# EAGLE design breakout_stm32f407 (EAGLE 5.12)

## Sheet 1 of 3
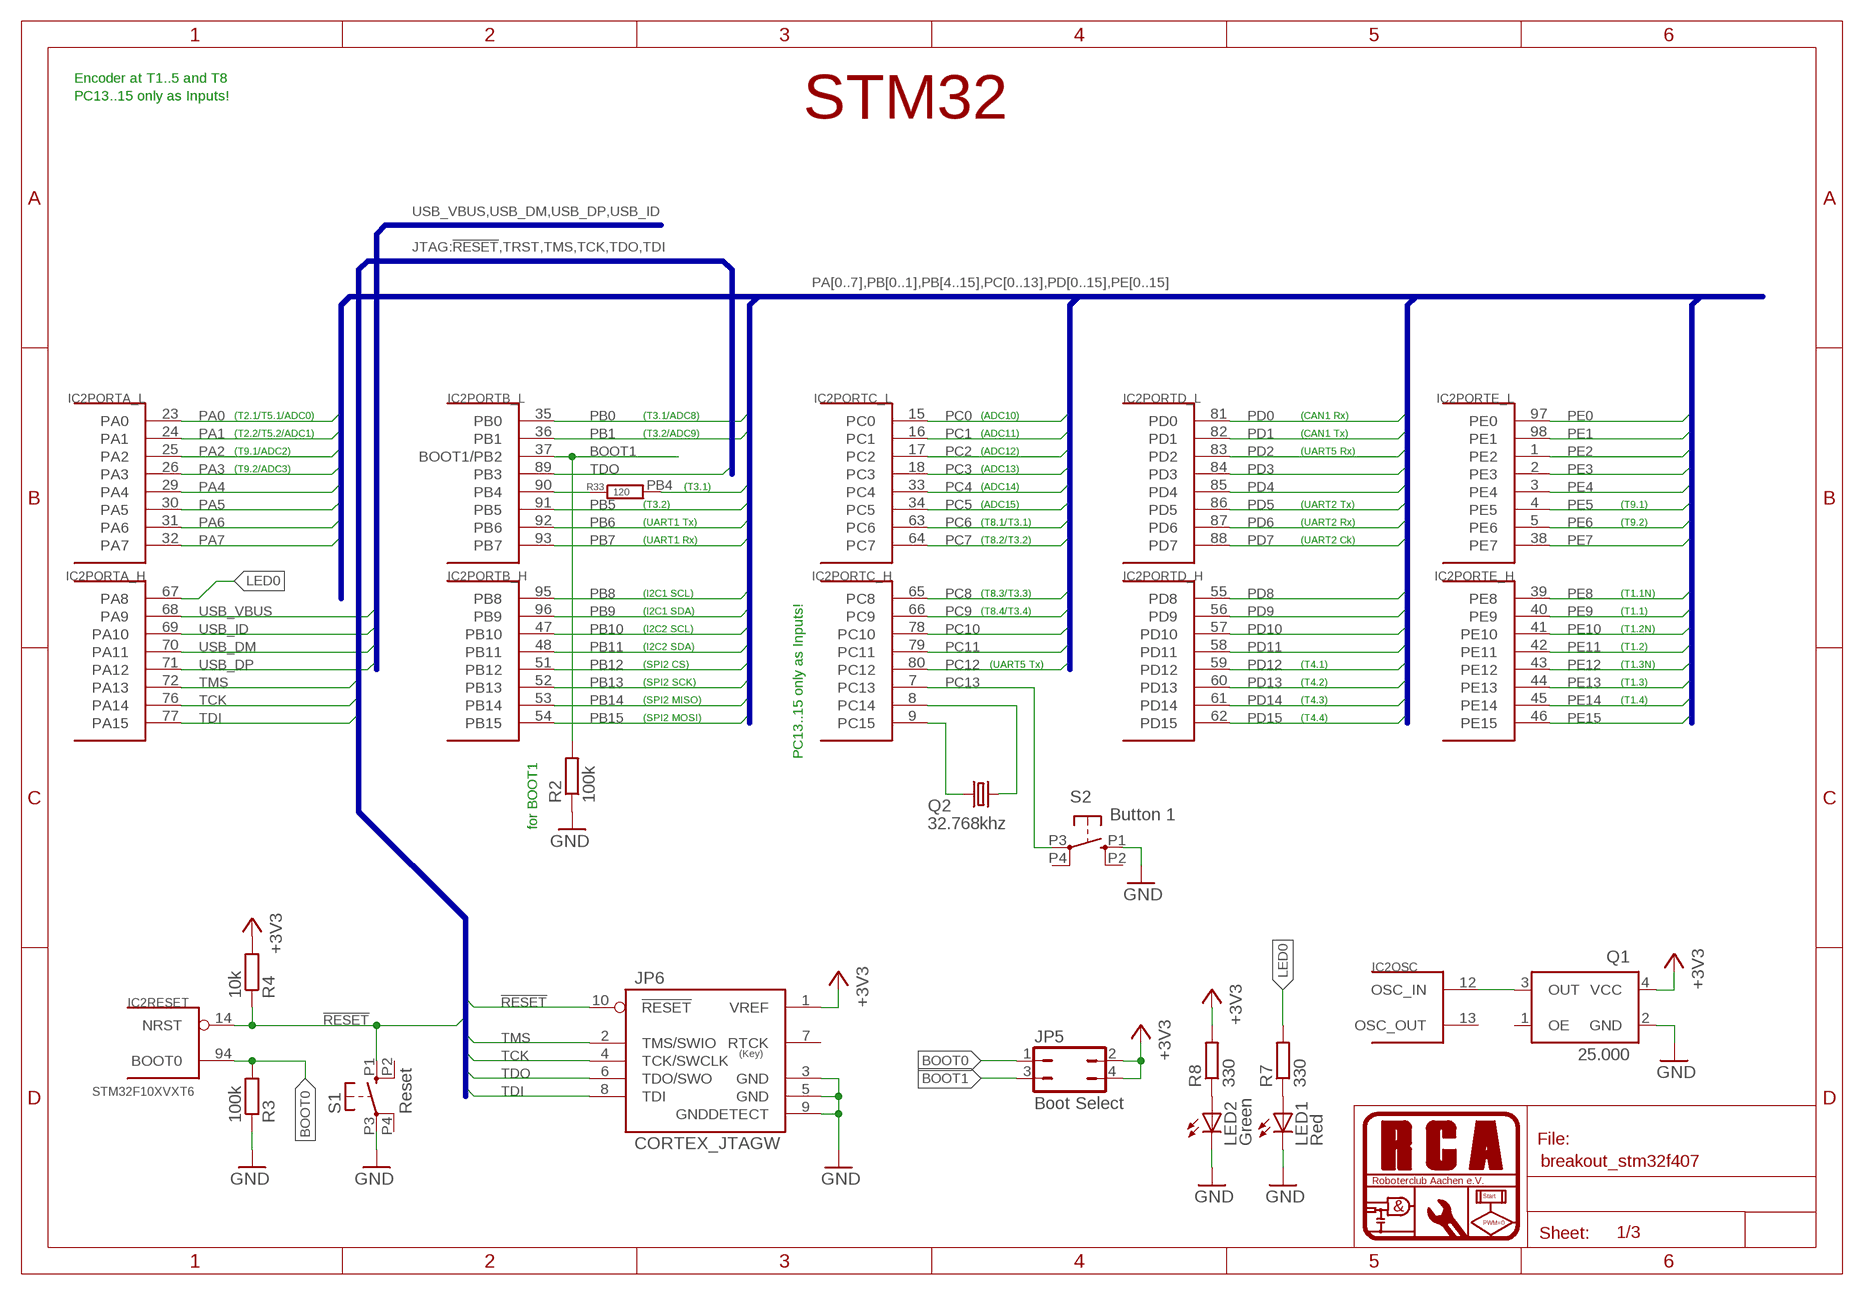
[diagram p0: schematic, sheet 1]

### Parts
IC2  STM32F10XVXT6  [TQFP100]
JP5  Boot Select  JP2Q  [JP2Q]
JP6  CORTEX_JTAGW  [ML10]
LED1  Red  LEDCHIPLED_0805  [CHIPLED_0805]
LED2  Green  LEDCHIPLED_0805  [CHIPLED_0805]
Q1  25.000  XO53  [XO53]
Q2  32.768khz  CRYSTALTC26H  [TC26H]
R2  100k  R-EU_R0805  [R0805]
R3  100k  R-EU_R0805  [R0805]
R4  10k  R-EU_R0805  [R0805]
R7  330  R-EU_R0805  [R0805]
R8  330  R-EU_R0805  [R0805]
R33  120  R-EU_R0805  [R0805]
S1  Reset  10-XXLSH  [B3F-10XX-SMD]
S2  Button 1  10-XXLSH  [B3F-10XX-SMD]

### Nets
!RESET: IC2.14(RESET:NRST) JP6.10(!RESET) R4.1 S1.P1(S)
+3V3: JP5.2 JP5.4 JP6.1(VREF) Q1.4(VCC) R4.2 R8.2 ; also sheet 2,3
BOOT0: IC2.94(RESET:BOOT0) JP5.1 R3.2
BOOT1: IC2.37(PORTB_L:BOOT1/PB2) JP5.3 R2.2
GND: JP6.3(GND) JP6.5(GND) JP6.9(GNDDETECT) LED1.C LED2.C Q1.2(GND) R2.1 R3.1 S1.P3(P) S2.P1(S) ; also sheet 2,3
LED0: IC2.67(PORTA_H:PA8) R7.2
N$1: IC2.12(OSC:OSC_IN) Q1.3(OUT)
N$2: IC2.9(PORTC_H:PC15) Q2.1
N$3: IC2.8(PORTC_H:PC14) Q2.2
N$4: LED1.A R7.1
N$9: LED2.A R8.1
N$34: IC2.90(PORTB_L:PB4) R33.1
PA0: IC2.23(PORTA_L:PA0) ; also sheet 2
PA1: IC2.24(PORTA_L:PA1) ; also sheet 2
PA2: IC2.25(PORTA_L:PA2) ; also sheet 2
PA3: IC2.26(PORTA_L:PA3) ; also sheet 2
PA4: IC2.29(PORTA_L:PA4) ; also sheet 2
PA5: IC2.30(PORTA_L:PA5) ; also sheet 2
PA6: IC2.31(PORTA_L:PA6) ; also sheet 2
PA7: IC2.32(PORTA_L:PA7) ; also sheet 2
PB0: IC2.35(PORTB_L:PB0) ; also sheet 2
PB1: IC2.36(PORTB_L:PB1) ; also sheet 2
PB4: R33.2 ; also sheet 2
PB5: IC2.91(PORTB_L:PB5) ; also sheet 2
PB6: IC2.92(PORTB_L:PB6) ; also sheet 2
PB7: IC2.93(PORTB_L:PB7) ; also sheet 2
PB8: IC2.95(PORTB_H:PB8) ; also sheet 2
PB9: IC2.96(PORTB_H:PB9) ; also sheet 2
PB10: IC2.47(PORTB_H:PB10) ; also sheet 2
PB11: IC2.48(PORTB_H:PB11) ; also sheet 2
PB12: IC2.51(PORTB_H:PB12) ; also sheet 2
PB13: IC2.52(PORTB_H:PB13) ; also sheet 2
PB14: IC2.53(PORTB_H:PB14) ; also sheet 2
PB15: IC2.54(PORTB_H:PB15) ; also sheet 2
PC0: IC2.15(PORTC_L:PC0) ; also sheet 2
PC1: IC2.16(PORTC_L:PC1) ; also sheet 2
PC2: IC2.17(PORTC_L:PC2) ; also sheet 2
PC3: IC2.18(PORTC_L:PC3) ; also sheet 2
PC4: IC2.33(PORTC_L:PC4) ; also sheet 2
PC5: IC2.34(PORTC_L:PC5) ; also sheet 2
PC6: IC2.63(PORTC_L:PC6) ; also sheet 2
PC7: IC2.64(PORTC_L:PC7) ; also sheet 2
PC8: IC2.65(PORTC_H:PC8) ; also sheet 2
PC9: IC2.66(PORTC_H:PC9) ; also sheet 2
PC10: IC2.78(PORTC_H:PC10) ; also sheet 2
PC11: IC2.79(PORTC_H:PC11) ; also sheet 2
PC12: IC2.80(PORTC_H:PC12) ; also sheet 2
PC13: IC2.7(PORTC_H:PC13) S2.P3(P)
PD0: IC2.81(PORTD_L:PD0) ; also sheet 2
PD1: IC2.82(PORTD_L:PD1) ; also sheet 2
PD2: IC2.83(PORTD_L:PD2) ; also sheet 2
PD3: IC2.84(PORTD_L:PD3) ; also sheet 2
PD4: IC2.85(PORTD_L:PD4) ; also sheet 2
PD5: IC2.86(PORTD_L:PD5) ; also sheet 2
PD6: IC2.87(PORTD_L:PD6) ; also sheet 2
PD7: IC2.88(PORTD_L:PD7) ; also sheet 2
PD8: IC2.55(PORTD_H:PD8) ; also sheet 2
PD9: IC2.56(PORTD_H:PD9) ; also sheet 2
PD10: IC2.57(PORTD_H:PD10) ; also sheet 2
PD11: IC2.58(PORTD_H:PD11) ; also sheet 2
PD12: IC2.59(PORTD_H:PD12) ; also sheet 2
PD13: IC2.60(PORTD_H:PD13) ; also sheet 2
PD14: IC2.61(PORTD_H:PD14) ; also sheet 2
PD15: IC2.62(PORTD_H:PD15) ; also sheet 2
PE0: IC2.97(PORTE_L:PE0) ; also sheet 2
PE1: IC2.98(PORTE_L:PE1) ; also sheet 2
PE2: IC2.1(PORTE_L:PE2) ; also sheet 2
PE3: IC2.2(PORTE_L:PE3) ; also sheet 2
PE4: IC2.3(PORTE_L:PE4) ; also sheet 2
PE5: IC2.4(PORTE_L:PE5) ; also sheet 2
PE6: IC2.5(PORTE_L:PE6) ; also sheet 2
PE7: IC2.38(PORTE_L:PE7) ; also sheet 2
PE8: IC2.39(PORTE_H:PE8) ; also sheet 2
PE9: IC2.40(PORTE_H:PE9) ; also sheet 2
PE10: IC2.41(PORTE_H:PE10) ; also sheet 2
PE11: IC2.42(PORTE_H:PE11) ; also sheet 2
PE12: IC2.43(PORTE_H:PE12) ; also sheet 2
PE13: IC2.44(PORTE_H:PE13) ; also sheet 2
PE14: IC2.45(PORTE_H:PE14) ; also sheet 2
PE15: IC2.46(PORTE_H:PE15) ; also sheet 2
TCK: IC2.76(PORTA_H:PA14) JP6.4(TCK/SWCLK)
TDI: IC2.77(PORTA_H:PA15) JP6.8(TDI)
TDO: IC2.89(PORTB_L:PB3) JP6.6(TDO/SWO)
TMS: IC2.72(PORTA_H:PA13) JP6.2(TMS/SWIO)
USB_DM: IC2.70(PORTA_H:PA11) ; also sheet 2
USB_DP: IC2.71(PORTA_H:PA12) ; also sheet 2
USB_ID: IC2.69(PORTA_H:PA10) ; also sheet 2
USB_VBUS: IC2.68(PORTA_H:PA9) ; also sheet 2,3
Unconnected: IC2.13(OSC:OSC_OUT) JP6.7(RTCK) Q1.1(OE) S1.P2(S1) S1.P4(P1) S2.P2(S1) S2.P4(P1)

### Buses
JTAG:!RESET,TRST,TMS,TCK,TDO,TDI
USB_VBUS,USB_DM,USB_DP,USB_ID
PA[0..7],PB[0..1],PB[4..15],PC[0..13],PD[0..15],PE[0..15]

### Notes on the sheet
- Encoder at T1..5 and T8
- PC13..15 only as Inputs!
- STM32
- (T2.1/T5.1/ADC0) | (T3.1/ADC8) | (ADC10) | (CAN1 Rx)
- (T2.2/T5.2/ADC1) | (T3.2/ADC9) | (ADC11) | (CAN1 Tx)
- (T9.1/ADC2) | (ADC12) | (UART5 Rx)
- (T9.2/ADC3) | (ADC13)
- (T3.1) | (ADC14)
- (T3.2) | (ADC15) | (UART2 Tx) | (T9.1)
- (UART1 Tx) | (T8.1/T3.1) | (UART2 Rx) | (T9.2)
- (UART1 Rx) | (T8.2/T3.2) | (UART2 Ck)
- (I2C1 SCL) | (T8.3/T3.3) | (T1.1N)
- (I2C1 SDA) | (T8.4/T3.4) | (T1.1)
- (I2C2 SCL) | (T1.2N)
- (I2C2 SDA) | (T1.2)
- (SPI2 CS) | (UART5 Tx) | (T4.1) | (T1.3N)
- (SPI2 SCK) | (T4.2) | (T1.3)
- (SPI2 MISO) | (T4.3) | (T1.4)
- (SPI2 MOSI) | (T4.4)
- PC13..15 only as Inputs!
- for BOOT1

## Sheet 2 of 3
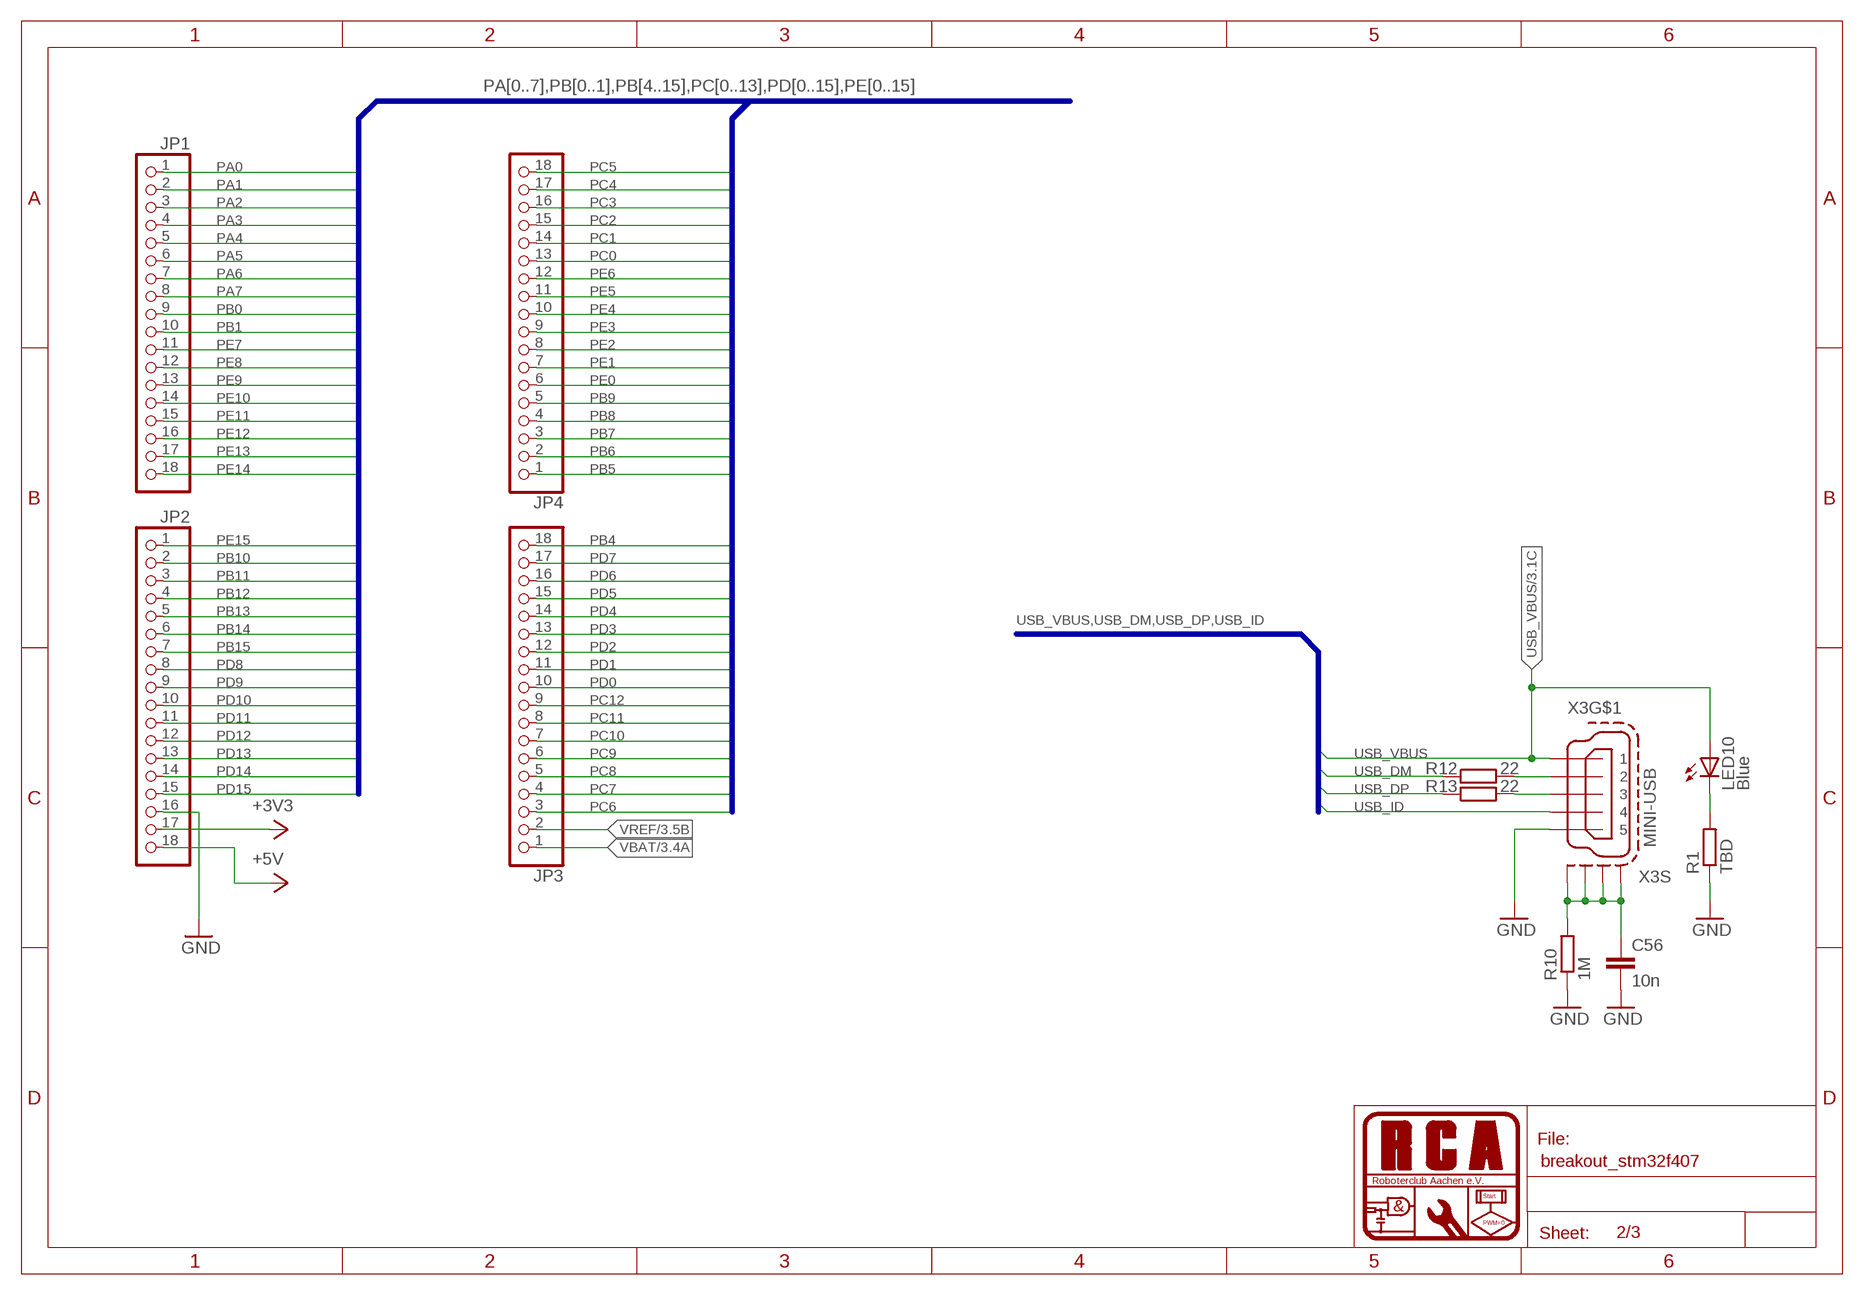
[diagram p1: schematic, sheet 2]

### Parts
C56  10n  C-EUC0603  [C0603]
JP1  PINHD-1X18_2.54  [1X18]
JP2  PINHD-1X18_2.54  [1X18]
JP3  PINHD-1X18_2.54  [1X18]
JP4  PINHD-1X18_2.54  [1X18]
LED10  Blue  LEDCHIPLED_0805  [CHIPLED_0805]
R1  TBD  R-EU_R0805  [R0805]
R10  1M  R-EU_R0805  [R0805]
R12  22  R-EU_R0805  [R0805]
R13  22  R-EU_R0805  [R0805]
X3  MINI-USB  MINI-USB-SCHIELD-32005-201  [32005-201]

### Nets
+3V3: JP2.17 ; also sheet 1,3
+5V: JP2.18 ; also sheet 3
GND: C56.2 JP2.16 R1.1 R10.1 X3.5 ; also sheet 1,3
N$16: R12.2 X3.2
N$17: R13.2 X3.3
N$33: LED10.C R1.2
N$42: C56.1 R10.2 X3.M1(S:S1) X3.M2(S:S2) X3.M3(S:S3) X3.M4(S:S4)
PA0: JP1.1 ; also sheet 1
PA1: JP1.2 ; also sheet 1
PA2: JP1.3 ; also sheet 1
PA3: JP1.4 ; also sheet 1
PA4: JP1.5 ; also sheet 1
PA5: JP1.6 ; also sheet 1
PA6: JP1.7 ; also sheet 1
PA7: JP1.8 ; also sheet 1
PB0: JP1.9 ; also sheet 1
PB1: JP1.10 ; also sheet 1
PB4: JP3.18 ; also sheet 1
PB5: JP4.1 ; also sheet 1
PB6: JP4.2 ; also sheet 1
PB7: JP4.3 ; also sheet 1
PB8: JP4.4 ; also sheet 1
PB9: JP4.5 ; also sheet 1
PB10: JP2.2 ; also sheet 1
PB11: JP2.3 ; also sheet 1
PB12: JP2.4 ; also sheet 1
PB13: JP2.5 ; also sheet 1
PB14: JP2.6 ; also sheet 1
PB15: JP2.7 ; also sheet 1
PC0: JP4.13 ; also sheet 1
PC1: JP4.14 ; also sheet 1
PC2: JP4.15 ; also sheet 1
PC3: JP4.16 ; also sheet 1
PC4: JP4.17 ; also sheet 1
PC5: JP4.18 ; also sheet 1
PC6: JP3.3 ; also sheet 1
PC7: JP3.4 ; also sheet 1
PC8: JP3.5 ; also sheet 1
PC9: JP3.6 ; also sheet 1
PC10: JP3.7 ; also sheet 1
PC11: JP3.8 ; also sheet 1
PC12: JP3.9 ; also sheet 1
PD0: JP3.10 ; also sheet 1
PD1: JP3.11 ; also sheet 1
PD2: JP3.12 ; also sheet 1
PD3: JP3.13 ; also sheet 1
PD4: JP3.14 ; also sheet 1
PD5: JP3.15 ; also sheet 1
PD6: JP3.16 ; also sheet 1
PD7: JP3.17 ; also sheet 1
PD8: JP2.8 ; also sheet 1
PD9: JP2.9 ; also sheet 1
PD10: JP2.10 ; also sheet 1
PD11: JP2.11 ; also sheet 1
PD12: JP2.12 ; also sheet 1
PD13: JP2.13 ; also sheet 1
PD14: JP2.14 ; also sheet 1
PD15: JP2.15 ; also sheet 1
PE0: JP4.6 ; also sheet 1
PE1: JP4.7 ; also sheet 1
PE2: JP4.8 ; also sheet 1
PE3: JP4.9 ; also sheet 1
PE4: JP4.10 ; also sheet 1
PE5: JP4.11 ; also sheet 1
PE6: JP4.12 ; also sheet 1
PE7: JP1.11 ; also sheet 1
PE8: JP1.12 ; also sheet 1
PE9: JP1.13 ; also sheet 1
PE10: JP1.14 ; also sheet 1
PE11: JP1.15 ; also sheet 1
PE12: JP1.16 ; also sheet 1
PE13: JP1.17 ; also sheet 1
PE14: JP1.18 ; also sheet 1
PE15: JP2.1 ; also sheet 1
USB_DM: R12.1 ; also sheet 1
USB_DP: R13.1 ; also sheet 1
USB_ID: X3.4 ; also sheet 1
USB_VBUS: LED10.A X3.1 ; also sheet 1,3
VBAT: JP3.1 ; also sheet 3
VREF: JP3.2 ; also sheet 3

### Buses
USB_VBUS,USB_DM,USB_DP,USB_ID
PA[0..7],PB[0..1],PB[4..15],PC[0..13],PD[0..15],PE[0..15]

## Sheet 3 of 3
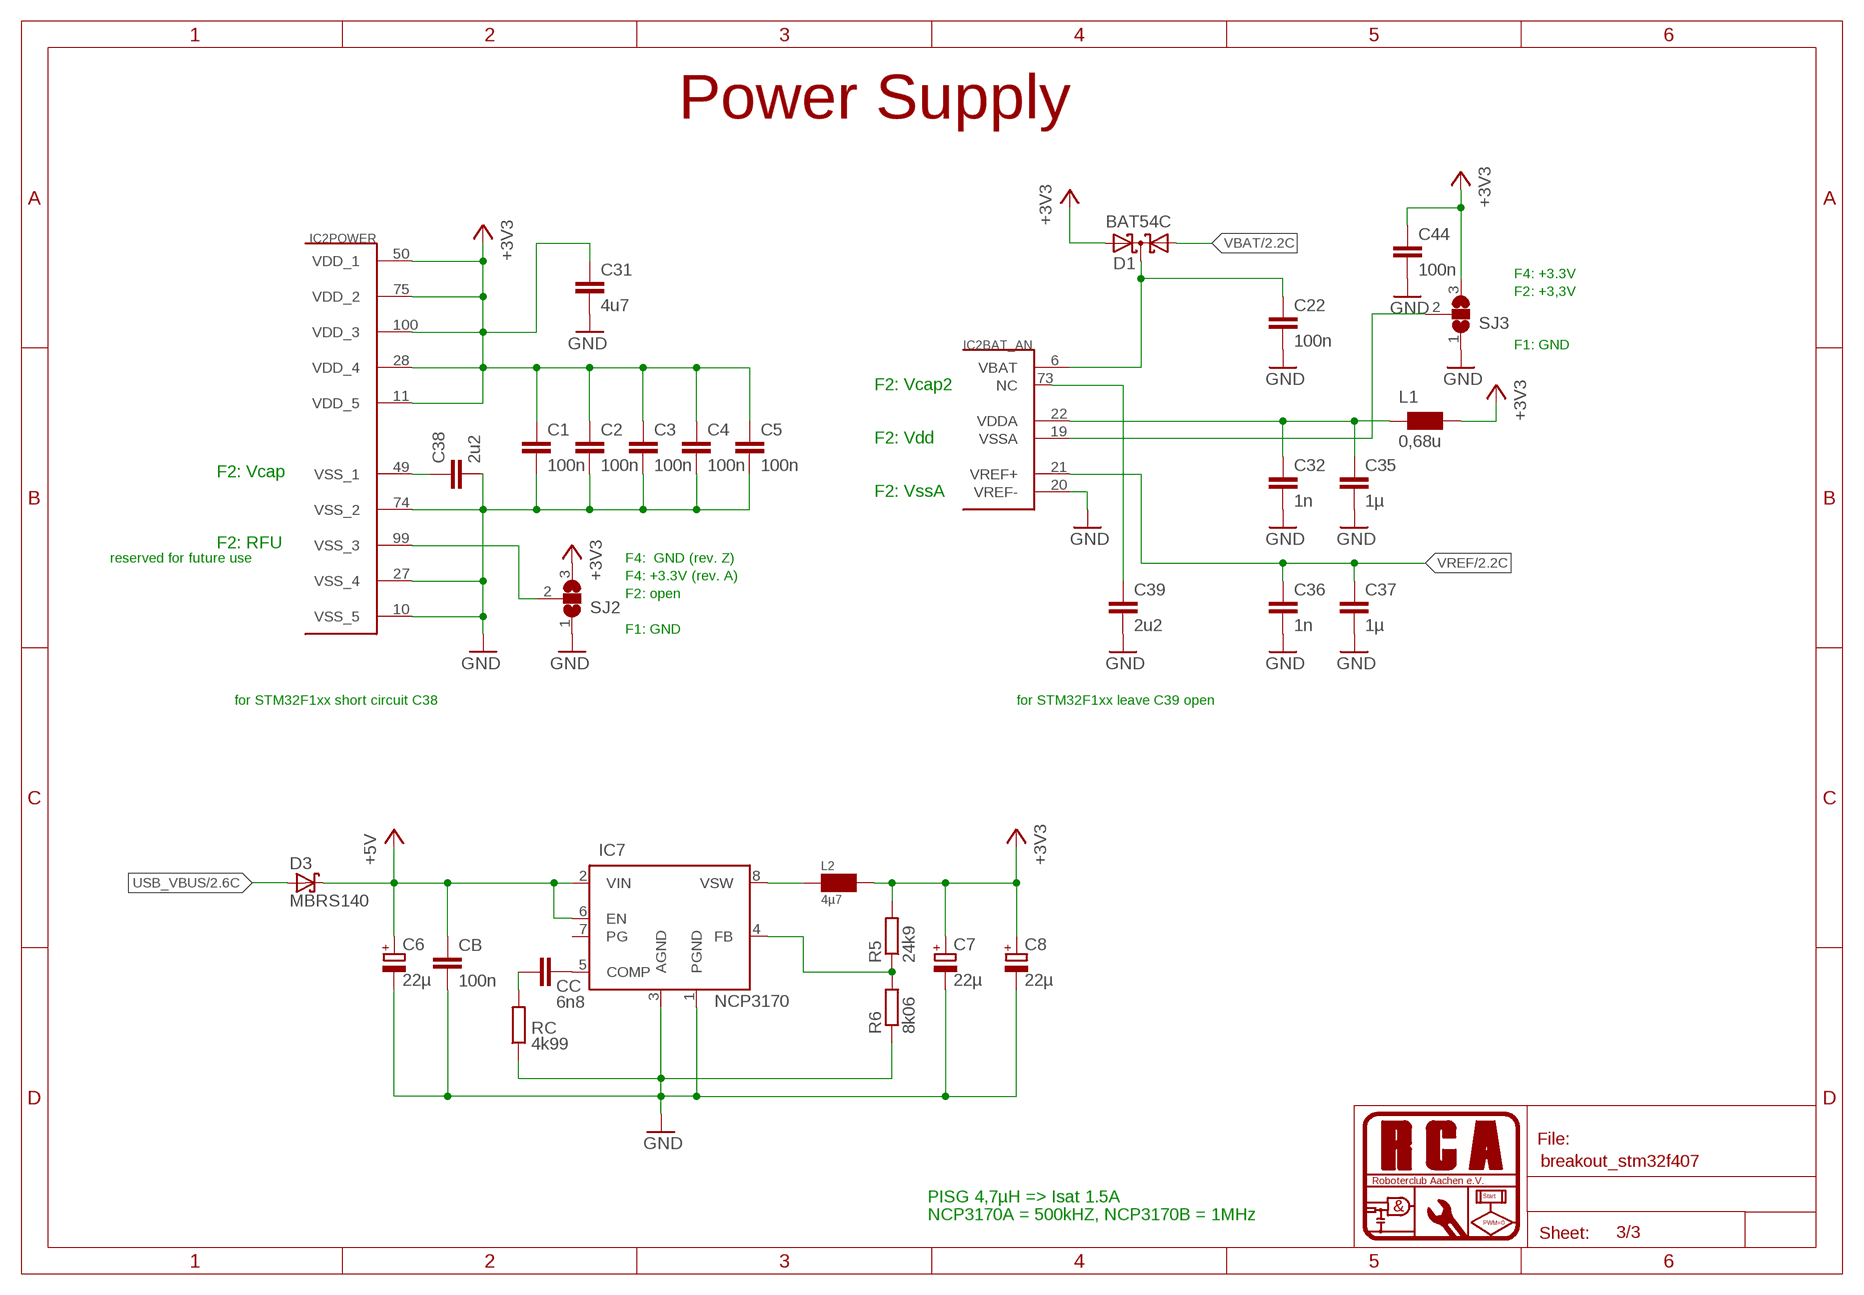
[diagram p2: schematic, sheet 3]

### Parts
C1  100n  C-EUC0603  [C0603]
C2  100n  C-EUC0603  [C0603]
C3  100n  C-EUC0603  [C0603]
C4  100n  C-EUC0603  [C0603]
C5  100n  C-EUC0603  [C0603]
C6  22µ  CPOL-EUSMCD  [SMC_D]
C7  22µ  CPOL-EUSMCC  [SMC_C]
C8  22µ  CPOL-EUSMCC  [SMC_C]
C22  100n  C-EUC0603  [C0603]
C31  4u7  C-EUC0805  [C0805]
C32  1n  C-EUC0603  [C0603]
C35  1µ  C-EUC0805  [C0805]
C36  1n  C-EUC0603  [C0603]
C37  1µ  C-EUC0805  [C0805]
C38  2u2  C-EUC0805  [C0805]
C39  2u2  C-EUC0805  [C0805]
C44  100n  C-EUC0603  [C0603]
CB  100n  C-EUC0603  [C0603]
CC  6n8  C-EUC0805  [C0805]
D1  BAT54C  [SOT23]
D3  MBRS140  MBRS130LT3  [SMB]
IC7  NCP3170  [SO08]
L1  0,68u  WE-KIHQ_0805  [WE-KI_0805_B]
L2  4µ7  INDUCTOR-PISG  [L-PISG]
R5  24k9  R-EU_M0805  [M0805]
R6  8k06  R-EU_M0805  [M0805]
RC  4k99  R-EU_M0805  [M0805]
SJ2  SJ2WS  [SJ_2S]
SJ3  SJ2WS  [SJ_2S]

### Nets
+3V3: C1.1 C2.1 C3.1 C4.1 C5.1 C7.+ C8.+ C31.1 C44.1 D1.2(A2) IC2.11(POWER:VDD_5) IC2.28(POWER:VDD_4) IC2.50(POWER:VDD_1) IC2.75(POWER:VDD_2) IC2.100(POWER:VDD_3) L1.1 L2.2 R5.2 SJ2.3 SJ3.3 ; also sheet 1,2
+5V: C6.+ CB.1 D3.C IC7.2(VIN) IC7.6(EN) ; also sheet 2
GND: C1.2 C2.2 C3.2 C4.2 C5.2 C6.- C7.- C8.- C22.2 C31.2 C32.2 C35.2 C36.2 C37.2 C38.2 C39.2 C44.2 CB.2 IC2.10(POWER:VSS_5) IC2.20(BAT_AN:VREF-) IC2.27(POWER:VSS_4) IC2.74(POWER:VSS_2) IC7.1(PGND) IC7.3(AGND) R6.1 RC.1 SJ2.1 SJ3.1 ; also sheet 1,2
N$5: CC.2 RC.2
N$6: CC.1 IC7.5(COMP)
N$7: IC7.8(VSW) L2.1
N$8: IC7.4(FB) R5.1 R6.2
N$27: C38.1 IC2.49(POWER:VSS_1)
N$28: IC2.99(POWER:VSS_3) SJ2.2
N$29: C39.1 IC2.73(BAT_AN:NC)
N$30: IC2.19(BAT_AN:VSSA) SJ3.2
N$36: C32.1 C35.1 IC2.22(BAT_AN:VDDA) L1.2
USB_VBUS: D3.A ; also sheet 1,2
VBAT: D1.1(A1) ; also sheet 2
VBAT_: C22.1 D1.3(CC) IC2.6(BAT_AN:VBAT)
VREF: C36.1 C37.1 IC2.21(BAT_AN:VREF+) ; also sheet 2
Unconnected: IC7.7(PG)

### Notes on the sheet
- Power Supply
- F4: +3.3V
- F2: +3,3V
- F1: GND
- F2: Vcap2
- F2: Vdd
- F2: Vcap
- F2: VssA
- F2: RFU
- reserved for future use | F4:  GND (rev. Z)
- F4: +3.3V (rev. A)
- F2: open
- F1: GND
- for STM32F1xx short circuit C38 | for STM32F1xx leave C39 open
- PISG 4,7µH => Isat 1.5A
- NCP3170A = 500kHZ, NCP3170B = 1MHz

## Library data of the parts
C1-C5 C22 C31 C32 C35-C39 C44 C56 CB CC = rcl:C-EU: CAPACITOR, European symbol
C6-C8 = rcl:CPOL-EU: POLARIZED CAPACITOR, European symbol
D1 = diode:BAT54C: Schottky Diodes Source: Fairchild .. BAT54.pdf
D3 = diode:MBRS130LT3: Schottky Power Rectifier Source: http://www.onsemi.com/pub/Collateral/MBRS130LT3-D.PDF
IC2 = stm32:STM32F10XVXT6: STM32F101/103 100 pin LQFP
IC7 = rca_spgversorgung:NCP3170: Synchronous PWM Switching Converter The NCP3170 is a flexible synchronous PWM Switching Buck Regulator. The NCP3170 operates from 4.5V to 18V, sourcing up to 3A and is capable of producing output voltages as low as 0.8V. The NCP3170 also incorporates current mode control. To reduce the number of external components, a number of features are internally set including soft start, power good detection, and switching frequency. The NCP3170 is currently available in an SOIC-8 package.
JP1-JP4 = pinhead2:PINHD-1X18: PIN HEADER
JP5 = jumper:JP2Q: JUMPER
JP6 = rca_stecker:CORTEX_JTAG
L1 = wuerth-elektronik:WE-KIHQ: SMD Wire Wound Ceramic Inductor WE-KIHQ - High current - Highest Quality factor in size 0805 - up to 98 - High thermal stability - High SRF -- Bluetooth -- Wireless LAN -- RF oscillation circuit -- IF impedance matching -- IG choke
L2 = rca_sontiges:INDUCTOR: SMD-Power-Induktivitäten z.B. PISM, Ferrit, 150µ, Reichelt Bestellnr.: L-PISM 150µ
LED1 LED2 LED10 = led:LED: LED OSRAM: - CHIPLED LG R971, LG N971, LY N971, LG Q971, LY Q971, LO R971, LY R971 LH N974, LH R974 LS Q976, LO Q976, LY Q976 LO Q996 - Hyper CHIPLED LW Q18S LB Q993, LB Q99A, LB R99A - SideLED LS A670, LO A670, LY A670, LG A670, LP A670 LB A673, LV A673, LT A673, LW A673 LH A674 LY A675 LS A676, LA A676, LO A676, LY A676, LW A676 LS A679, LY A679, LG A679 - Hyper Micro SIDELED® LS Y876, LA Y876, LO Y876, LY Y876 LT Y87S - SmartLED LW L88C, LW L88S LB L89C, LB L89S, LG L890 LS L89K, LO L89K, LY L89K LS L896, LA L896, LO L896, LY L896 - TOPLED LS T670, LO T670, LY T670, LG T670, LP T670 LSG T670, LSP T670, LSY T670, LOP T670, LYG T670 LG T671, LOG T671, LSG T671 LB T673, LV T673, LT T673, LW T673 LH T674 LS T676, LA T676, LO T676, LY T676, LB T676, LH T676, LSB T676, LW T676 LB T67C, LV T67C, LT T67C, LS T67K, LO T67K, LY T67K, LW E67C LS E67B, LA E67B, LO E67B, LY E67B, LB E67C, LV E67C, LT E67C LW T67C LS T679, LY T679, LG T679 LS T770, LO T770, LY T770, LG T770, LP T770 LB T773, LV T773, LT T773, LW T773 LH T774 LS E675, LA E675, LY E675, LS T675 LS T776, LA T776, LO T776, LY T776, LB T776 LHGB T686 LT T68C, LB T68C - Hyper Mini TOPLED® LB M676 - Mini TOPLED Santana® LG M470 LS M47K, LO M47K, LY M47K Source: http://www.osram.convergy.de LUXEON: - LUMILED® LXK2-PW12-R00, LXK2-PW12-S00, LXK2-PW14-U00, LXK2-PW14-V00 LXK2-PM12-R00, LXK2-PM12-S00, LXK2-PM14-U00 LXK2-PE12-Q00, LXK2-PE12-R00, LXK2-PE12-S00, LXK2-PE14-T00, LXK2-PE14-U00 LXK2-PB12-K00, LXK2-PB12-L00, LXK2-PB12-M00, LXK2-PB14-N00, LXK2-PB14-P00, LXK2-PB14-Q00 LXK2-PR12-L00, LXK2-PR12-M00, LXK2-PR14-Q00, LXK2-PR14-R00 LXK2-PD12-Q00, LXK2-PD12-R00, LXK2-PD12-S00 LXK2-PH12-R00, LXK2-PH12-S00 LXK2-PL12-P00, LXK2-PL12-Q00, LXK2-PL12-R00 Source: www.luxeon.com KINGBRIGHT: KA-3528ASYC Source: www.kingbright.com
Q1 = rca_sontiges:XO: XO91 Series Oscillators Frequency Range 500 kHz to 125 MHz Supply voltage range 1.8, 2.5, 3.3 or 5.0 Volts Gibt es in der 3,3V Version bei Reichelt (XO91 #Wert) Datenblatt: http://www.reichelt.de/?;ACTION=7;LA=6;OPEN=0;INDEX=0;FILENAME=B400%252FXO91.pdf XO53 Series Oscillators Frequency Range 2.5 MHz to 125 MHz Supply voltage range 1.8, 2.5, 3.3 Volts Gibt es in der 3,3V Version bei Reichelt (XO53 #Wert)
Q2 = crystal:CRYSTAL: CRYSTAL; OC_FARNELL: unknown; OC_NEWARK: unknown
R1-R8 R10 R12 R13 R33 RC = rcl:R-EU_: RESISTOR, European symbol
S1 S2 = rca_sontiges:10-XX*: OMRON SWITCH
SJ2 SJ3 = rca_sontiges:SJ2W: SMD solder JUMPER
X3 = con-cypressindustries:MINI-USB-SCHIELD-: MINI USB-B Conector Source: www.cypressindustries.com

## Board
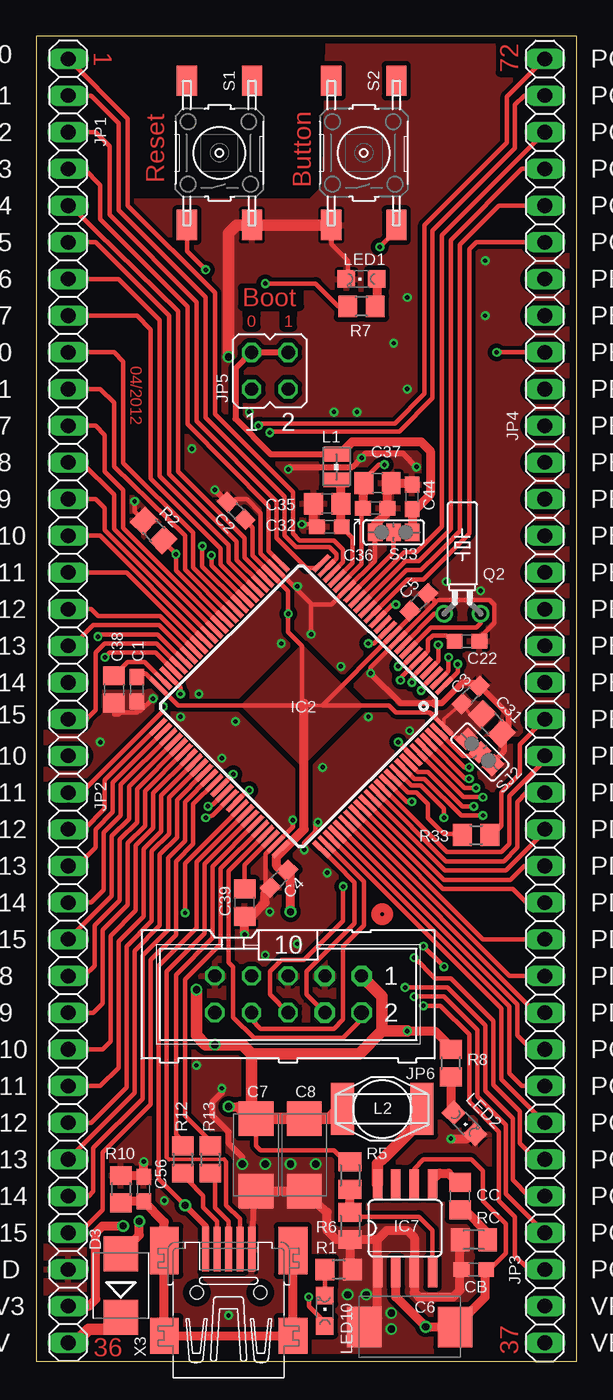
[diagram p3: board, top side]
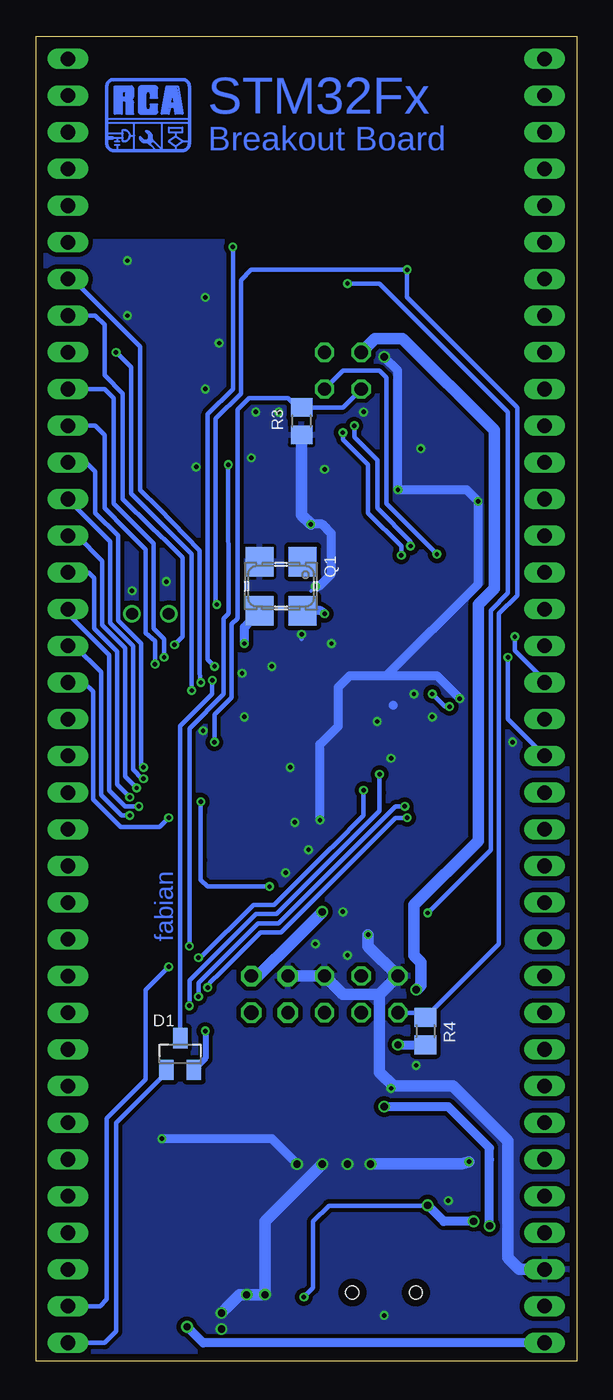
[diagram p4: board, bottom side, seen from below]

Size 37.45 x 91.75 mm. Coordinates in mm from the lower left corner, seen from the top.
Outline: 0,0 37.45,0 37.45,91.75 0,91.75 0,0
Copper layers (1*16): Top 0.035mm / dielectric 1.5mm / Bottom 0.035mm
Design rules "PCB-POOL": minimum track width 6mil, minimum drill 12mil, track to track 6mil, track to pad 6mil, pad to pad 6mil, via to via 6mil, smd to smd 6mil, copper to edge 20mil, drill to drill 8mil, minimum pad ring 8mil, minimum via ring 6mil, stop-mask expansion 3mil, vias tented up to drill 0mil, thermal gap 8mil

### Footprints (pad centres in the part's own frame; a part is rotated, then mirrored left to right if it is on the bottom)
C0603 = smd 1.1 x 1: 1 -0.85,0; 2 0.85,0
SMC_D = smd 2.4 x 2.8: + -3.15,0; - 3.15,0
SMC_C = smd 2.4 x 2.4: + -2.5,0; - 2.5,0
C0805 = smd 1.3 x 1.5: 1 -0.95,0; 2 0.95,0
SOT23 = smd 1 x 1.4: 1 -0.95,-1.1; 2 0.95,-1.1; 3 0,1.1
SMB = smd 2.4 x 2.4: A 2.2,0; C -2.2,0
TQFP100 = smd 1.5 x 0.33: 1 -8,6; 2 -8,5.5; 3 -8,5; 4 -8,4.5; 5 -8,4; 6 -8,3.5; 7 -8,3; 8 -8,2.5; 9 -8,2; 10 -8,1.5; 11 -8,1; 12 -8,0.5; 13 -8,0; 14 -8,-0.5; 15 -8,-1; 16 -8,-1.5; 17 -8,-2; 18 -8,-2.5; 19 -8,-3; 20 -8,-3.5; 21 -8,-4; 22 -8,-4.5; 23 -8,-5; 24 -8,-5.5; 25 -8,-6; 51 8,-6; 52 8,-5.5; 53 8,-5; 54 8,-4.5; 55 8,-4; 56 8,-3.5; 57 8,-3; 58 8,-2.5; 59 8,-2; 60 8,-1.5; 61 8,-1; 62 8,-0.5; 63 8,0; 64 8,0.5; 65 8,1; 66 8,1.5; 67 8,2; 68 8,2.5; 69 8,3; 70 8,3.5; 71 8,4; 72 8,4.5; 73 8,5; 74 8,5.5; 75 8,6 | smd 0.33 x 1.5: 26 -6,-8; 27 -5.5,-8; 28 -5,-8; 29 -4.5,-8; 30 -4,-8; 31 -3.5,-8; 32 -3,-8; 33 -2.5,-8; 34 -2,-8; 35 -1.5,-8; 36 -1,-8; 37 -0.5,-8; 38 0,-8; 39 0.5,-8; 40 1,-8; 41 1.5,-8; 42 2,-8; 43 2.5,-8; 44 3,-8; 45 3.5,-8; 46 4,-8; 47 4.5,-8; 48 5,-8; 49 5.5,-8; 50 6,-8; 76 6,8; 77 5.5,8; 78 5,8; 79 4.5,8; 80 4,8; 81 3.5,8; 82 3,8; 83 2.5,8; 84 2,8; 85 1.5,8; 86 1,8; 87 0.5,8; 88 0,8; 89 -0.5,8; 90 -1,8; 91 -1.5,8; 92 -2,8; 93 -2.5,8; 94 -3,8; 95 -3.5,8; 96 -4,8; 97 -4.5,8; 98 -5,8; 99 -5.5,8; 100 -6,8
SO08 = smd 0.66 x 2.032: 1 -1.905,-3.073; 2 -0.635,-3.073; 3 0.635,-3.073; 4 1.905,-3.073; 5 1.905,3.073; 6 0.635,3.073; 7 -0.635,3.073; 8 -1.905,3.073
1X18 = drill 1.016 long: 1 -21.59,0; 2 -19.05,0; 3 -16.51,0; 4 -13.97,0; 5 -11.43,0; 6 -8.89,0; 7 -6.35,0; 8 -3.81,0; 9 -1.27,0; 10 1.27,0; 11 3.81,0; 12 6.35,0; 13 8.89,0; 14 11.43,0; 15 13.97,0; 16 16.51,0; 17 19.05,0; 18 21.59,0
JP2Q = drill 0.914 octagon: 1 -1.27,-1.27; 2 -1.27,1.27; 3 1.27,-1.27; 4 1.27,1.27
ML10 = drill 0.914 pad 1.422 octagon: 1 -5.08,-1.27; 3 -2.54,-1.27; 4 -2.54,1.27 | drill 1.016 pad 1.422 octagon: 2 -5.08,1.27 | drill 0.914 octagon: 5 0,-1.27; 6 0,1.27; 7 2.54,-1.27; 8 2.54,1.27; 9 5.08,-1.27; 10 5.08,1.27
WE-KI_0805_B = smd 1.02 x 1.78: 1 -0.89,0; 2 0.89,0
L-PISG = smd 1.6 x 3.6: 1 -2.75,0; 2 2.75,0
CHIPLED_0805 = smd 1.2 x 1.2: A 0,-1.05; C 0,1.05
XO53 = smd 1.93 x 2.032: 1 -1.5,-1.7; 2 1.5,-1.7; 3 1.5,1.7; 4 -1.5,1.7
TC26H = drill 0.813 round: 1 -1.27,0; 2 1.27,0
R0805 = smd 1.3 x 1.5: 1 -0.95,0; 2 0.95,0
M0805 = smd 1.3 x 1.6: 1 -0.95,0; 2 0.95,0
B3F-10XX-SMD = smd 2.1 x 1.4: P1 -5,2.25; P2 5,2.25; P3 -5,-2.25; P4 5,-2.25
SJ_2S = smd 1 x 1.2: 1 -1.286,0; 2 0,0; 3 1.286,0
32005-201 = smd 3.1 x 0.5: 1 3,1.6; 2 3,0.8; 3 3,0; 4 3,-0.8; 5 3,-1.6 | smd 2.5 x 2: M1 -3,-4.45; M2 -3,4.45 | smd 3.3 x 2: M3 2.9,4.45; M4 2.9,-4.45 | hole 0.9: 0,2.2; 0,-2.2

### Placement (x,y rotation side)
C1  6.99,46.51 270 top
C2  13.86,58.88 135 top
C3  30.1,46.13 45 top
C4  16.83,33.4 225 top
C5  26.51,52.55 45 top
C6  25.88,2.38 180 top
C7  15.24,14.29 270 top
C8  18.57,14.29 270 top
C22  29.84,49.85 0 top
C31  31.56,44.13 315 top
C32  20.32,57.78 180 top
C35  20.16,59.37 180 top
C36  23.5,59.05 0 top
C37  23.65,60.8 0 top
C38  5.4,46.51 270 top
C39  14.45,31.75 270 top
C44  26.03,59.85 90 top
C56  7.46,11.91 90 top
CB  30.32,6.35 180 top
CC  29.37,11.43 270 top
D1  27.46,21.27 0 bottom
D3  5.87,5.24 90 top
IC2  18.36,45.35 225 top
IC7  25.56,9.21 0 top
JP1  2.22,68.58 270 top
JP2  2.22,22.86 270 top
JP3  35.24,22.86 90 top
JP4  35.24,68.58 90 top
JP5  16.19,68.58 0 top
JP6  17.46,25.4 180 top
L1  20.8,61.91 270 top
L2  23.97,17.46 180 top
LED1  22.54,74.93 90 top
LED2  29.68,16.46 225 top
LED10  20,3.49 0 top
Q1  20.48,53.66 180 bottom
Q2  29.53,51.75 0 top
R1  20.96,6.35 180 top
R2  8.14,57.51 315 top
R3  19.05,65.09 90 bottom
R4  10.48,22.86 270 bottom
R5  21.75,12.86 90 top
R6  21.75,9.37 90 top
R7  22.54,73.03 180 top
R8  28.73,20.64 90 top
R10  5.87,11.91 270 top
R12  10.16,13.97 270 top
R13  12.06,13.97 270 top
R33  30.48,36.44 0 top
RC  30.32,8.41 0 top
S1  12.7,83.66 90 top
S2  22.7,83.66 90 top
SJ2  30.74,42.17 135 top
SJ3  24.76,57.39 0 top
U$1  [LOGO]  29.69,86.36 0 bottom
X3  13.33,4.76 90 top

### Tracks (layer width: path | path; a pad name or v marks a point on that pad's centre or on a via)
!RESET  (via drill 0.3)
  Top 0.305: IC2.14 24.69,52.39 v24.92,52.39 | S1.P1 10.45,76.86 v11.75,75.56
  Bottom 0.305: 12.07,24.13 10.16,24.13 5.4,28.89 5.4,51.75 4.13,53.02 4.13,66.04 11.75,73.66 v11.75,75.56 22.54,75.56 23.26,74.85 23.26,66.99 25,65.25 25,52.47 v24.92,52.39 | R4.1 10.48,24.13 12.07,24.13 | 12.07,24.13 JP6.10
+3V3  (via drill 0.3, 0.5)
  Top 0.254: 25.91,51.48 C5.1 | 18.42,45.4 19.83,45.4 | SJ2.3 29.75,43.08 29.85,43.18 29.01,43.18 IC2.100 28.26,44.45 C3.1 30.06,44.8 C31.1
  Top 0.305: IC2.75 18.42,36.92 18.42,45.4 | IC2.100 27.27,44.93 24.92,44.93 24.45,45.4 19.83,45.4 IC2.11 25.91,51.48 | 18.42,45.4 18.42,49.53 17.46,50.48 v17.46,51.75 17.46,53.32 IC2.28 15,55.78 15,57.71 14.46,58.25 C2.1 | 18.42,45.4 9.82,45.4 IC2.50 7.6,47.62 7.14,47.62 6.83,46.99 C1.1 | R5.2 21.43,13.81 20.64,14.61 15.56,14.61 15.24,14.92 C7.+ 14.88,16.83 15.24,16.83
  Top 0.406: L1.1 16.26,62.8 13.81,65.25 13.81,68.74 JP5.2 JP5.4
  Top 0.61: 18.46,16.83 C8.+ 18.42,16.83 | 14.96,16.83 C7.+ 15.04,16.99 14.6,16.99 13.97,17.62 v13.33,17.62 | v17.62,31.11 17.62,33.34 | 17.62,33.34 17.62,33.81 C4.1 17.14,33.81 | 17.14,33.81 16.67,34.29 16.67,34.92 18.57,36.83 18.57,45.56 | 17.14,33.81 17.15,33.81 17.62,33.34 | SJ3.3 26.05,58.98 C44.1 26.09,59.05 26.19,58.9 27.3,60.01 27.3,63.02 26.67,63.66 21.91,63.66 21.05,62.8 L1.1 | JP2.17 3.65,3.81 4.13,4.29 4.13,8.89 4.6,9.37 v6.03,9.37 | R8.2 28.73,21.75 27.62,22.86 v25.72,22.86
  Top 0.813: L2.2 20.96,17.46 20.32,16.83 18.46,16.83 | 14.96,16.83 15.24,16.83 | 15.24,16.83 18.42,16.83 | 23.97,22.86 22.38,21.27 14.92,21.27 | 23.97,22.86 23.97,25.24 JP6.1 | 14.92,21.27 14.92,17.14 15.24,16.83 | C7.+ 15.24,16.83 | 14.92,21.27 14.29,21.91 v12.38,21.91 11.75,21.91 11.11,22.54 v11.11,25.72 | 23.97,22.86 v25.72,22.86
  Bottom 0.406: v25.72,22.86 25.72,20.97 D1.2 | R4.2
  Bottom 0.61: v6.03,9.37 6.03,13.97 6.03,14.76 8.89,17.62 9.84,17.62 v13.33,17.62 | v12.38,21.91 R4.2 | Q1.4 17.73,51.96 v17.46,51.75
  Bottom 0.813: JP6.1 22.38,26.67 22.07,26.67 19.53,29.21 v17.62,31.11 | v11.11,25.72 10.8,26.04 10.8,27.62 11.27,28.1 11.27,31.59 6.83,36.04 6.83,52.39 5.71,53.5 5.71,64.45 12.07,70.8 13.97,70.8 JP5.2
  pour Top (isolate 0.305): 14.29,45.4 18.42,49.53 22.54,45.4 18.42,41.27
  pour Top (isolate 0.305, no thermals): 26.67,45.4 28.26,45.4 29.21,46.35 29.53,46.35 30.16,45.72 31.12,45.72 31.75,45.09 31.75,44.77 29.85,42.86 29.21,42.86
+5V  (via drill 0.5)
  Top 0.305: IC7.6 26.19,13.34 26.83,13.97 30.16,13.97 30.96,13.18 30.96,11.11 32.54,9.53 32.54,7.46 31.43,6.35 31.27,6.35 CB.1
  Top 0.61: IC7.2 24.92,4.45 v26.99,2.38 C6.+ 29.37,2.72 29.05,2.38 31.11,4.44 31.12,4.44 31.12,6.19 CB.1
  Top 0.813: JP2.18 2.7,1.27 3.65,2.22 5.06,2.22 D3.C
  Bottom 0.61: JP2.18 25.88,1.27 v26.99,2.38 | v26.99,2.38
BOOT0  (via drill 0.3)
  Top 0.305: IC2.94 v25.09,42.86 v25.08,42.86
  Bottom 0.305: v25.09,42.86 25.09,44.76 23.89,45.96 23.89,51.04 23.49,51.44 23.49,65.41 23.49,65.88 22.7,66.67 20,66.67 19.37,66.04 16.99,66.04 16.19,66.04 | 16.19,66.04 JP5.1 | 16.19,66.04
  Bottom 0.813: R3.2 19.37,66.04
BOOT1  (via drill 0.3)
  Top 0.305: IC2.37 9.68,54.73 v9.68,55.88 8.81,56.75 R2.2
  Bottom 0.305: v9.68,55.88 13.18,59.37 13.18,68.1 13.65,68.58 16.19,68.58 JP5.3
GND  (via drill 0.3, 0.5)
  Top 0.254: 30.74,46.73 C3.2 30.6,46.99 | 31.65,41.49 SJ2.1
  Top 0.305: 27.59,52.45 IC2.10 23.18,48.04 v23.18,47.62 | 27.59,52.45 27.59,52.66 27.15,53.1 C5.2 | v17.78,37.47 17.78,36.99 IC2.74 15.91,35.12 15.91,32.99 16.19,32.7 C4.2 | 17.83,53.66 IC2.27 15.56,55.93 15.56,58.74 14.6,59.69 13.81,59.69 13.6,59.48 C2.2 | 17.83,53.66 v18.1,53.66 | C38.2 5.4,44.77 5.71,44.77 5.87,44.93 6.99,44.93 C1.2 7.22,45.01 v8.1,45.88 | C7.- 15.09,11.64 | SJ3.1 23.48,55.42 IC2.20 20.45,52.39 19.1,52.39 | 27.59,52.45 27.7,52.55 27.86,52.7 31.43,52.7 31.75,52.39 31.75,51.12 30.48,49.85 C22.2 | 17.83,53.66 19.1,52.39 | R2.1 6.83,58.83 v6.83,59.53 | C32.2 19.31,57.94 v18.42,57.94 | 29.37,6.35 CB.2 | S2.P1 20.45,77.34 21.59,76.2 | 21.59,76.2 21.59,76.04 | 21.59,76.2 21.59,75.47 LED1.C | 19.1,52.39 19.05,52.39 v19.05,50.32 | v18.57,35.4 18.57,35.88 19.37,36.67 19.37,37.15 | v22.54,62.55
  Top 0.406: 30.74,46.73 32.7,44.77 32.7,43.93 C31.2 32.39,43.31 32.39,42.23 31.65,41.49 | 30.6,46.99 29.53,46.99 28.1,45.56 27.62,45.56 25.24,45.56 v23.18,47.62 | 15.09,11.64 X3.5 | C2.2 13.23,59.48 v12.38,60.33 | v26.35,61.91 25.4,62.87 22.86,62.87 v22.54,62.55 21.91,61.91 17.62,61.91 v17.46,61.75 | v14.29,13.65 14.29,14.13 13.33,15.08 13.33,15.88 12.22,16.99 12.22,17.94 12.86,18.57 v12.86,18.89
  Top 0.61: C6.- 23.65,2.99 IC7.1 23.65,8.41 | CB.2 29.37,6.35 RC.1 | C7.- 14.92,11.75 18.37,11.75 C8.- 18.42,11.75 20.16,10.32 20.16,9.05 20.8,8.41 R6.1 | R1.1 21.75,6.51 21.75,6.99 R6.1 | R10.1 7.36,12.86 C56.2 7.46,13.65 v7.46,13.81 | C4.2 15.87,32.45 15.87,31.75 14.92,30.8 C39.2 14.37,30.8 C39.2 v14.45,29.53 | C37.2 24.35,60.54 C36.2 24.29,59 24.29,58.74 23.48,57.93 SJ3.1 | C44.2 25.98,60.7 25.88,60.8 C37.2 | C37.2 | C32.2 19.47,57.84 19.21,58.1 C35.2 | 29.37,6.35 29.37,4.92 28.89,4.45 26.51,4.45 26.19,4.76 IC7.3 26.19,8.57 25.72,9.05 24.29,9.05 23.65,8.41 | 23.65,8.41 R6.1 | LED2.C 30.26,15.82 29.85,15.4 v28.73,15.4 | 27.62,45.56
  Top 0.813: v13.33,69.53 13.33,78.11 13.89,78.66 S1.P3 S2.P1
  Bottom 0.254: v17.78,37.47 17.78,37.78 | v18.1,53.66 18.42,53.34 | v23.18,47.62
  Bottom 0.305: v19.05,50.32 19.05,50.01
  Bottom 0.61: v8.1,45.88 9.68,47.47 15.72,47.47 16.51,46.67 16.51,43.97 17.78,42.7 v17.78,37.47 | 13.18,47.47 6.83,53.82 v6.83,59.53 7.62,60.33 v12.38,60.33 12.38,68.58 v13.33,69.53 | v18.42,57.94 17.62,57.94 16.99,57.31 16.99,54.5 17.8,53.68 18.07,53.68 v18.1,53.66 | v28.73,15.4 21.11,15.4 v19.37,13.65 | 12.7,45.4
  Bottom 0.813: 13.65,25.4 JP6.9 14.45,28.73 v14.45,29.53 | 13.65,25.4 16.19,25.4 JP6.5 JP6.3 | 13.65,25.4 13.65,20 12.7,19.05 8.57,19.05 4.76,15.24 4.76,7.14 3.97,6.35 JP2.16 | v14.29,13.65 7.94,13.65 v7.46,13.81 | v17.62,13.65 18.57,12.7 21.59,9.68 v21.59,4.6 v22.86,4.6 23.34,4.6 24.29,3.65 v24.61,3.33 | v7.46,13.81 | R3.1 19.05,58.58 v18.42,57.94
  other vias: 15.88,13.65 15.88,28.1 18.1,28.89 16.19,31.11 20.16,33.81 23.02,44.61 19.53,37.31 19.84,41.12 25.88,43.66 10,44.61 13.81,44.29 21.11,48.1 11.27,46.2 16.99,49.69 22.23,65.72 14.76,65.72 28.42,53.98 30.8,53.34 12.86,41.75 4.45,42.86 20.64,65.72 25.72,67.31 25.72,73.66 24.77,70.49 31.12,72.39 31.12,76.2 10.79,63.18 8.89,11.11 11.11,20.48 13.33,3.17 24.61,2.22
  pour Top (isolate 0.305, rank 6, no thermals): 13.49,10.64 13.49,13.49 13.97,13.97 21.27,13.81 25.24,10 30.16,10 31.12,9.05 31.27,-1.43 20.16,-1.43 20.32,6.19 20.32,6.51 16.19,10.32 13.81,10.32
  pour Bottom (isolate 0.305, rank 6): -1.59,77.47 39.05,77.47 39.05,-1.27 -1.59,-1.27
  pour Top (isolate 0.305, rank 6): -2.86,80.33 19.05,80.33 20,81.28 20.32,93.98 40.32,93.98 40.32,-2.54 -2.86,-2.54
  pour Top (isolate 0.305, rank 6, no thermals): 4.45,46.35 7.94,46.35 8.25,46.04 8.25,44.45 7.62,43.81 4.45,43.81
LED0  (via drill 0.3)
  Top 0.305: IC2.67 10.32,34.45 v10.32,31.04 | v15.87,74.61 19.37,74.61 20.96,73.03 R7.2
  Bottom 0.305: v10.32,31.04 10.24,31.11 5.95,35.4 5.95,51.99 4.76,53.18 4.76,65.72 13.65,74.61 v15.87,74.61
N$1  (via drill 0.3)
  Top 0.305: IC2.12 23.41,49.69 v23.02,49.69
  Bottom 0.61: Q1.3 23.02,50.8 v23.02,49.69
N$2
  Top 0.305: IC2.9 27.59,51.75 Q2.1
N$3
  Top 0.305: IC2.8 27.35,50.8 30.48,50.8 30.8,51.12 Q2.2
N$4
  Top 0.61: R7.1 23.65,73.66 23.65,74.71 LED1.A
N$5
  Top 0.61: RC.2 31.27,8.89 29.69,10.47 29.53,10.47 CC.2
N$6
  Top 0.61: IC7.5 27.46,12.54 27.94,13.02 28.57,13.02 29.37,12.22 CC.1
N$7
  Top 0.61: 24.61,14.61
  Top 0.813: IC7.8 23.65,13.65 24.13,14.13 24.61,14.61 26.19,16.19 26.51,16.35 L2.1
N$8
  Top 0.305: R6.2 22.07,10.32 22.54,10 26.51,10 27.46,9.05 IC7.4
  Top 0.61: R6.2 R5.1
N$9
  Top 0.61: LED2.A 29.05,17.14 28.78,17.42 28.78,19.64 R8.1
N$16
  Top 0.254: 10.48,12.54 R12.2
  Top 0.305: X3.2 12.54,9.68 11.58,10.64 11.58,11.44 10.48,12.54
N$17
  Top 0.254: 12.38,12.7 R13.2
  Top 0.305: X3.3 13.33,9.68 12.38,10.64 12.38,12.7
N$27
  Top 0.305: IC2.49 7.51,48.42 6.35,48.42 5.24,47.31 C38.1
N$28
  Top 0.254: 30.8,41.91 SJ2.2
  Top 0.305: IC2.99 29.58,41.91 30.8,41.91
N$29
  Top 0.305: C39.1 14.45,34.36 IC2.73
N$30
  Top 0.305: IC2.19 24.76,55.99 SJ3.2
N$33
  Top 0.305: LED10.C R1.2
N$34
  Top 0.305: IC2.90 25.75,39.37 26.35,39.37 27.15,38.58 27.15,37.62 28.26,36.51 29.21,36.51 | 29.21,36.51 29.37,36.51 | 29.21,36.51 R33.1
N$36
  Top 0.305: IC2.22 21.91,55.26 21.91,56.99 21.49,57.41 C32.1
  Top 0.61: C32.1 21.11,57.84 C35.1 21.11,60.71 L1.2
N$42
  Top 0.305: R10.2 5.97,11.06 C56.1
  Top 0.61: X3.M4 X3.M1 X3.M2 X3.M3 8.89,9.63 C56.1 5.77,11.06 5.71,11.11
PA0
  Top 0.305: IC2.23 21.27,55.33 21.27,56.2 20.96,56.52 20.64,56.83 20.32,56.83 18.26,56.83 17.78,57.31 17.78,60.17 12.38,65.56 12.38,73.98 6.35,80.01 6.35,86.04 JP1.1 | JP1.1
PA1
  Top 0.305: IC2.24 20.8,55.56 20.8,55.88 20.32,56.36 18.02,56.36 17.22,57.15 17.22,59.85 11.75,65.33 11.75,73.66 5.71,79.69 5.71,85.72 3.81,87.63 JP1.2
PA2
  Top 0.305: IC2.25 19.37,54.93 18.73,54.93 16.67,56.99 16.67,59.53 11.11,65.09 11.11,73.34 5.08,79.38 5.08,84.14 4.13,85.09 JP1.3
PA3
  Top 0.305: IC2.26 16.11,56.08 16.11,59.21 10.48,64.89 10.48,73.03 4.45,79.06 4.45,81.44 3.33,82.55 JP1.4
PA4
  Top 0.305: IC2.29 14.45,55.63 14.45,56.99 9.84,61.59 9.84,72.71 4.13,78.26 2.54,79.85 JP1.5 | JP1.5
PA5
  Top 0.305: 9.21,61.44 13.89,56.75 13.89,55.48 IC2.30 | 9.21,61.44 9.21,61.43 | 9.21,61.44 9.21,72.39 4.13,77.47 JP1.6
PA6
  Top 0.305: IC2.31 13.33,55.32 13.33,56.52 8.57,61.28 8.57,72.07 5.71,74.93 JP1.7
PA7
  Top 0.305: IC2.32 12.78,55.17 12.78,56.28 7.94,61.12 7.94,71.44 6.99,72.39 JP1.8
PB0
  Top 0.305: JP1.9 5.4,69.85 6.03,69.22 6.03,68.26 6.03,62.18 10.87,57.39 10.87,54.95 IC2.35
PB1
  Top 0.305: JP1.10 4.45,67.31 5.4,66.36 5.4,61.95 10.32,57.15 10.32,54.8 IC2.36
PB4
  Top 0.305: R33.2 31.59,36.44 32.23,37.07 32.23,39.37 33.5,40.64 33.5,42.7 JP3.18
PB5  (via drill 0.3)
  Top 0.305: IC2.91 25.98,39.85 26.67,39.85 27.78,38.73 28.26,38.26 v28.26,37.62
  Bottom 0.305: v28.26,37.62 28.89,36.99 31.59,36.99 33.5,38.89 33.5,46.35 34.13,46.99 JP4.1
PB6  (via drill 0.3)
  Top 0.305: IC2.92 26.21,40.32 26.91,40.32 29.45,37.78 v30.96,37.78
  Top 0.406: v30.96,37.78
  Bottom 0.305: v30.96,37.78 31.51,37.78 32.94,39.21 32.94,47.7 34.77,49.53 JP4.2
PB7  (via drill 0.3)
  Top 0.305: IC2.93 26.45,40.8 27.15,40.8 29.53,38.42 v30.32,38.42
  Bottom 0.305: v30.32,38.42 31.27,38.42 32.39,39.53 32.39,48.9 35.24,51.75 JP4.3
PB8  (via drill 0.3)
  Top 0.305: IC2.95 29.61,39.05 v30.96,39.05
  Bottom 0.305: v30.96,39.05 31.83,39.93 31.83,49.13 33.42,50.72 33.42,54.21 33.81,54.61 JP4.4
PB9  (via drill 0.3)
  Top 0.305: IC2.96 29.68,39.69 v30.48,39.69
  Bottom 0.305: v30.48,39.69 30.96,40.16 31.27,40.48 31.27,49.37 32.86,50.96 32.86,55.4 34.61,57.15 JP4.5
  Bottom 0.406: v30.48,39.69
PB10  (via drill 0.3)
  Top 0.305: v4.76,48.74 4.84,48.82 5.08,49.05 8.29,49.05 IC2.47
  Bottom 0.305: JP2.2 4.76,44.45 v4.76,48.74
PB11  (via drill 0.3)
  Top 0.305: IC2.48 10,46.64 v10,46.2 | v8.81,45.32 8.81,45.01 3.18,39.37 JP2.3
  Bottom 0.305: v10,46.2 9.13,45.32 v8.81,45.32
PB12
  Top 0.305: IC2.51 4.76,40.23 4.76,38.26 3.33,36.83 JP2.4
PB13
  Top 0.305: IC2.52 5.32,40.08 5.32,38.02 4.13,36.83 4.13,35.56 2.86,34.29 JP2.5
PB14
  Top 0.305: IC2.53 5.87,39.93 5.87,37.78 4.68,36.59 4.68,32.62 3.81,31.75 JP2.6
PB15
  Top 0.305: IC2.54 6.43,39.78 6.43,37.54 5.24,36.35 5.24,32.23 2.7,29.69 JP2.7
PC0
  Top 0.305: IC2.15 25.73,54.13 26.83,54.13 30,57.31 30,76.99 30.48,77.47 JP4.13
PC1
  Top 0.305: IC2.16 25.66,54.77 26.67,54.77 27.78,55.88 28.34,56.44 29.37,57.47 29.37,77.31 32.07,80.01 JP4.14
PC2
  Top 0.305: IC2.17 25.59,55.4 26.51,55.4 28.73,57.63 28.73,77.63 33.65,82.55 JP4.15
PC3
  Top 0.305: IC2.18 25.52,56.04 26.35,56.04 27.3,56.99 28.1,57.78 28.1,77.95 JP4.16
PC4  (via drill 0.3)
  Top 0.305: IC2.33 12.14,55.1 v12.14,55.8 | v16.19,64.29 16.27,64.37 25.16,64.37 27.46,66.67 27.46,78.26 33.18,83.98 33.18,87 33.81,87.63 JP4.17
  Bottom 0.305: v12.14,55.8 12.14,56.44 14.45,58.74 14.45,62.07 16.19,63.82 v16.19,64.29
PC5  (via drill 0.3)
  Top 0.305: IC2.34 11.51,55.03 v11.51,56.44 | v15.4,64.77 | v15.4,64.77 15.56,64.93 24.84,64.93 26.91,66.99 26.91,78.66 32.62,84.38 32.62,87.55 JP4.18
  Bottom 0.305: v11.51,56.44 11.51,56.75 13.81,59.05 13.81,62.39 15.4,63.98 v15.4,64.77
PC6  (via drill 0.3)
  Top 0.305: IC2.63 13.49,40.48 v13.65,40.64 | JP3.3 34.13,6.35 33.18,7.3 33.18,10 32.07,11.11 32.07,15.88 30,17.94 30,22.62 28.02,24.61 v26.83,24.61
  Bottom 0.305: v13.65,40.64 13.65,39.37 13.65,38.1 20.8,30.96 22.23,30.96 26.83,26.35 v26.83,24.61
PC7  (via drill 0.3)
  Top 0.305: IC2.64 12.3,38.58 v11.91,38.42 | JP3.4 33.5,10.64 32.54,11.59 32.54,16.35 30.56,18.34 30.56,22.94 28.26,25.24 v26.19,25.24
  Bottom 0.305: v11.91,38.42 12.07,38.42 12.54,38.42 20.64,30.32 22.07,30.32 26.19,26.19 v26.19,25.24
PC8  (via drill 0.3)
  Top 0.305: IC2.65 12.21,37.78 v11.75,37.62 | JP3.5 34.13,11.43 33.02,12.54 33.02,16.83 31.12,18.73 31.12,23.26 28.5,25.88 v25.56,25.88
  Bottom 0.305: v11.75,37.62 12.54,37.62 20.48,29.69 21.91,29.69 23.97,27.62 24.76,26.83 25.24,26.35 25.56,26.04 v25.56,25.88
PC9  (via drill 0.3)
  Top 0.305: JP3.6 34.61,13.97 33.5,15.08 33.5,17.3 31.91,18.89 31.67,19.13 31.67,23.57 28.73,26.51 27.62,26.51 v26.19,27.94 | IC2.66 14.66,39.53 v14.76,39.53
  Bottom 0.305: v26.19,27.94 26.03,27.94 22.38,31.59 20.96,31.59 17.14,35.4 16.83,35.72 14.76,37.78 v14.76,39.53 | v14.76,39.53 | v14.76,39.53
PC10
  Top 0.305: IC2.78 32.23,24.41 32.23,19.53 JP3.7
PC11
  Top 0.305: IC2.79 32.78,24.56 32.78,19.92 33.65,19.05 JP3.8
PC12
  Top 0.305: IC2.80 33.34,24.71 33.34,22.54 34.29,21.59 JP3.9
PC13  (via drill 0.3)
  Top 0.305: IC2.7 25.36,48.1 v25.08,48.1 | v23.81,77.15 24.76,78.11 24.76,78.47 S2.P3
  Bottom 0.305: v25.08,48.1 25.56,48.58 25.56,65.56 23.81,67.31 v23.81,77.15
PD0
  Top 0.305: IC2.81 34.63,24.13 JP3.10
PD1
  Top 0.305: IC2.82 32.8,26.67 JP3.11
PD2
  Top 0.305: IC2.83 30.96,29.21 JP3.12
PD3
  Top 0.305: IC2.84 28.18,32.7 33.02,32.7 33.97,31.75 JP3.13
PD4
  Top 0.305: IC2.85 28.25,33.34 32.86,33.34 33.81,34.29 JP3.14
PD5
  Top 0.305: IC2.86 28.32,33.97 32.54,33.97 35.24,36.67 JP3.15
PD6
  Top 0.305: IC2.87 28.39,34.61 32.38,34.61 33.34,35.56 33.34,38.73 33.97,39.37 JP3.16
PD7
  Top 0.305: IC2.88 28.47,35.24 32.23,35.24 32.78,35.8 32.78,39.13 35.24,41.59 JP3.17
PD8
  Top 0.305: IC2.55 6.99,39.63 6.99,37.31 5.79,36.12 5.79,31.91 4.05,30.16 4.05,27.38 3.33,26.67 JP2.8
PD9
  Top 0.305: IC2.56 7.54,39.48 7.54,37.07 6.35,35.88 6.35,31.59 4.6,29.84 4.6,24.77 3.97,24.13 JP2.9
PD10
  Top 0.305: IC2.57 8.1,39.33 8.1,36.91 6.91,35.72 6.91,31.19 5.16,29.45 5.16,22.15 4.6,21.59 JP2.10
PD11
  Top 0.305: IC2.58 8.65,39.17 8.65,36.67 7.46,35.48 7.46,30.8 5.71,29.05 5.71,20.32 4.45,19.05 JP2.11
PD12
  Top 0.305: IC2.59 9.21,39.02 9.21,36.51 8.02,35.32 8.02,30.48 6.27,28.73 6.27,18.97 3.81,16.51 JP2.12
PD13
  Top 0.305: IC2.60 9.76,38.87 9.76,36.27 8.57,35.08 8.57,30.16 6.83,28.42 6.83,18.57 JP2.13
PD14
  Top 0.305: IC2.61 10.32,38.72 10.32,36.04 9.13,34.85 9.13,29.84 7.38,28.1 7.38,18.18 3.97,14.76 3.97,11.75 3.65,11.43 JP2.14
PD15
  Top 0.305: IC2.62 10.87,38.57 10.87,35.8 9.68,34.61 9.68,29.53 7.94,27.78 7.94,17.78 4.6,14.45 4.6,10.48 3.02,8.89 JP2.15
PE0  (via drill 0.3)
  Top 0.305: IC2.97 29.75,40.32 v30,40.32
  Bottom 0.305: v30,40.32 30.08,40.32 30.72,40.96 30.72,49.53 32.31,51.12 32.31,56.75 JP4.6
PE1  (via drill 0.3)
  Top 0.305: IC2.98 29.66,41.12 v30,41.12
  Bottom 0.305: v30,41.12 30.16,41.27 30.16,49.69 31.75,51.28 31.75,57.15 33.34,58.74 33.34,61.59 33.97,62.23 JP4.7
PE2  (via drill 0.3)
  Top 0.305: IC2.1 29.2,47.7 v29.21,48.26
  Bottom 0.305: v29.21,48.26 29.21,49.85 29.85,50.4 29.85,56.2 31.19,57.55 | 31.19,57.55 | 31.19,57.55 | 31.19,57.55 32.7,59.05 32.7,64.14 33.34,64.77 JP4.8
PE3  (via drill 0.3)
  Top 0.305: IC2.2 28.57,47.78 v28.57,48.74
  Bottom 0.305: v28.57,48.74 28.57,50.01 29.29,50.72 29.29,56.59 30.64,57.94 | 30.64,57.94 | 30.64,57.94 32.07,59.37 32.07,66.67 32.7,67.31 JP4.9
PE4  (via drill 0.3)
  Top 0.305: IC2.3 26.83,46.74 v26.67,46.43 | v31.91,69.85 JP4.10
  Bottom 0.305: v26.67,46.43 26.67,46.75 26.67,55.88 30.88,60.09 30.88,68.82 v31.91,69.85
PE5  (via drill 0.3)
  Top 0.305: IC2.4 27.86,48.48 v27.86,49.61
  Bottom 0.305: v27.86,49.61 | v27.86,49.61 27.78,49.69 | 27.78,49.69 | 27.78,49.69 27.3,50.16 27.3,55.64 28.42,56.75 29.45,57.71 31.43,59.69 31.43,66.99 32.7,68.26 32.7,71.75 33.34,72.39 JP4.11
PE6  (via drill 0.3)
  Top 0.305: IC2.5 26.06,47.39 v26.03,46.99
  Bottom 0.305: v26.03,46.99 26.11,47.7 26.11,56.12 28.97,59.05 30.24,60.33 30.24,70.25 34.92,74.93 JP4.12
PE7
  Top 0.305: JP1.11 4.13,64.77 4.76,64.14 4.76,61.59 6.03,60.33 6.03,57.68 IC2.38
PE8
  Top 0.305: JP1.12 3.18,62.23 5.4,60.01 5.4,57.6 IC2.39
PE9
  Top 0.305: JP1.13 4.13,59.69 4.76,59.05 4.76,57.53 IC2.40
PE10
  Top 0.305: 3.49,57.15 JP1.14 4.44,57.15 IC2.41
PE11
  Top 0.305: JP1.15 2.86,54.61 3.49,54.61 6.27,54.61 IC2.42
PE12
  Top 0.305: 3.02,52.07 JP1.16 3.81,52.07 4.29,51.59 8.58,51.59 IC2.43
PE13
  Top 0.305: IC2.44 8.51,50.96 3.97,50.96 2.54,49.53 JP1.17
PE14  (via drill 0.3)
  Top 0.305: IC2.45 8.43,50.32 4.45,50.32 v4.29,50.16
  Bottom 0.305: v4.29,50.16 4.29,49.21 2.54,47.47 2.54,47.31 JP1.18
PE15
  Top 0.305: JP2.1 3.49,44.45 4.13,45.09 4.13,49.05 4.76,49.69 5.4,49.69 8.36,49.69 IC2.46
TCK
  Top 0.305: IC2.76 20.8,34.43 22.07,33.16 22.07,30.32 20.8,29.05 18.73,26.99 18.73,25.4 JP6.4
TDI
  Top 0.305: IC2.77 22.7,33.23 22.7,30.16 21.27,28.73 21.27,27.78 21.27,23.65 20.64,23.02 15.56,23.02 14.92,23.65 JP6.8
TDO  (via drill 0.3)
  Top 0.305: JP6.6 16.19,25.4 16.19,26.99 16.99,27.78 18.57,27.78 21.27,30.48 v21.27,32.86 | IC2.89 25.68,38.73 v26.03,38.73
  Bottom 0.305: v26.03,38.73 26.03,38.02 26.03,34.69 26.04,33.34 25.56,32.86 v21.27,32.86
TMS
  Top 0.305: IC2.72 13.33,33.96 13.33,27.62 13.65,27.3 13.65,23.81 15.08,22.38 21.27,22.38 22.54,23.65 JP6.2
USB_DM
  Top 0.305: R12.1 10.16,15.24 9.68,15.72 9.68,26.75 12.22,29.29 12.22,34.26 IC2.70
USB_DP
  Top 0.254: R13.1 12.38,14.92 12.22,14.92 12.22,15.24
  Top 0.305: 12.22,15.24 12.3,15 11.75,15.56 10.32,16.99 10.32,26.43 12.78,28.89 12.78,34.11 IC2.71
USB_ID
  Top 0.254: 13.02,13.97 9.21,13.97 | X3.4
  Top 0.305: IC2.69 11.67,34.41 11.67,29.61 9.05,26.99 9.05,14.13 9.21,13.97 | 13.02,13.97 13.18,13.81 13.18,10.79 14.13,9.84 X3.4
USB_VBUS  (via drill 0.3, 0.5)
  Top 0.305: 11.74,8.03 X3.1 | v10.32,10.79 8.49,12.62 8.49,27.38 11.11,30 11.11,34.56 IC2.68 | LED10.A 19.78,2.44 19.69,3.02 18.89,3.81 v18.89,4.45
  Top 0.406: 11.74,8.03 11.75,9.37 v10.32,10.79
  Top 0.61: D3.A 5.87,7.46 7.14,8.73 v7.14,9.68
  Bottom 0.305: v18.89,4.45 18.26,5.08 18.26,9.68 17.17,10.77 10.77,10.77 v10.32,10.79 | v18.89,4.45
  Bottom 0.61: v7.14,9.68 9.21,9.68 v10.32,10.79
VBAT
  Bottom 0.305: JP3.1 32.7,1.27 31.91,2.06 31.91,16.51 28.42,20 28.42,19.85 D1.1
VBAT_  (via drill 0.3)
  Top 0.305: C22.1 28.81,49.85 28.42,50.24 27.49,50.24 27.15,49.93 27.15,49.18 IC2.6 25.32,47.36 v25.24,47.15
  Bottom 0.305: v25.24,47.15 25.24,46.2 27.46,43.97 D1.3
VREF  (via drill 0.3)
  Top 0.305: IC2.21 22.54,55.19 22.54,58.9 22.7,59.05 C36.1 | v28.26,27.3 28.1,27.46 v26.83,28.73 | v24.13,62.07 23.73,62.07 22.7,61.04 22.7,60.88
  Top 0.61: 22.64,60.74 C36.1 | 22.64,60.74 C37.1 | 22.64,60.74 22.6,60.74 22.54,60.8 C37.1 22.7,60.88
  Bottom 0.305: JP3.2 33.02,3.81 32.54,4.29 32.54,16.83 29.85,19.53 29.85,25.72 v28.26,27.3 | v26.83,28.73 26.83,43.81 24.45,46.2 24.45,51.44 24.13,51.75 24.13,61.59 v24.13,62.07
(copper drawn outside any net)
  shapes: Top circle x1

### Text on the board
Top: 1 | 72 | Reset | Button | Boot | 0 | 1 | 04/2012 | 36 | 37
Bottom: STM32Fx | Breakout Board | fabian
tNames: PA0 | PC5 | PA1 | PC4 | PA2 | PC3 | PA3 | PC2 | PA4 | PC1 | PA5 | PC0 | PA6 | PE6 | PA7 | PE5 | PB0 | PE4 | PB1 | PE3 | PE7 | PE2 | PE8 | PE1 | PE9 | PE0 | PE10 | PB9 | PE11 | PB8 | PE12 | PB7 | PE13 | PB6 | PE14 | PB5 | PE15 | PB4 | PB10 | PD7 | PB11 | PD6 | PB12 | PD5 | PB13 | PD4 | PB14 | PD3 | PB15 | PD2 | PD8 | PD1 | PD9 | PD0 | PD10 | PC12 | PD11 | PC11 | PD12 | PC10 | PD13 | PC9 | PD14 | PC8 | PD15 | PC7 | GND | PC6 | +3V3 | VREF | +5V | VBAT